# Altium project Mini RFDx900 Board V1.PrjPcb
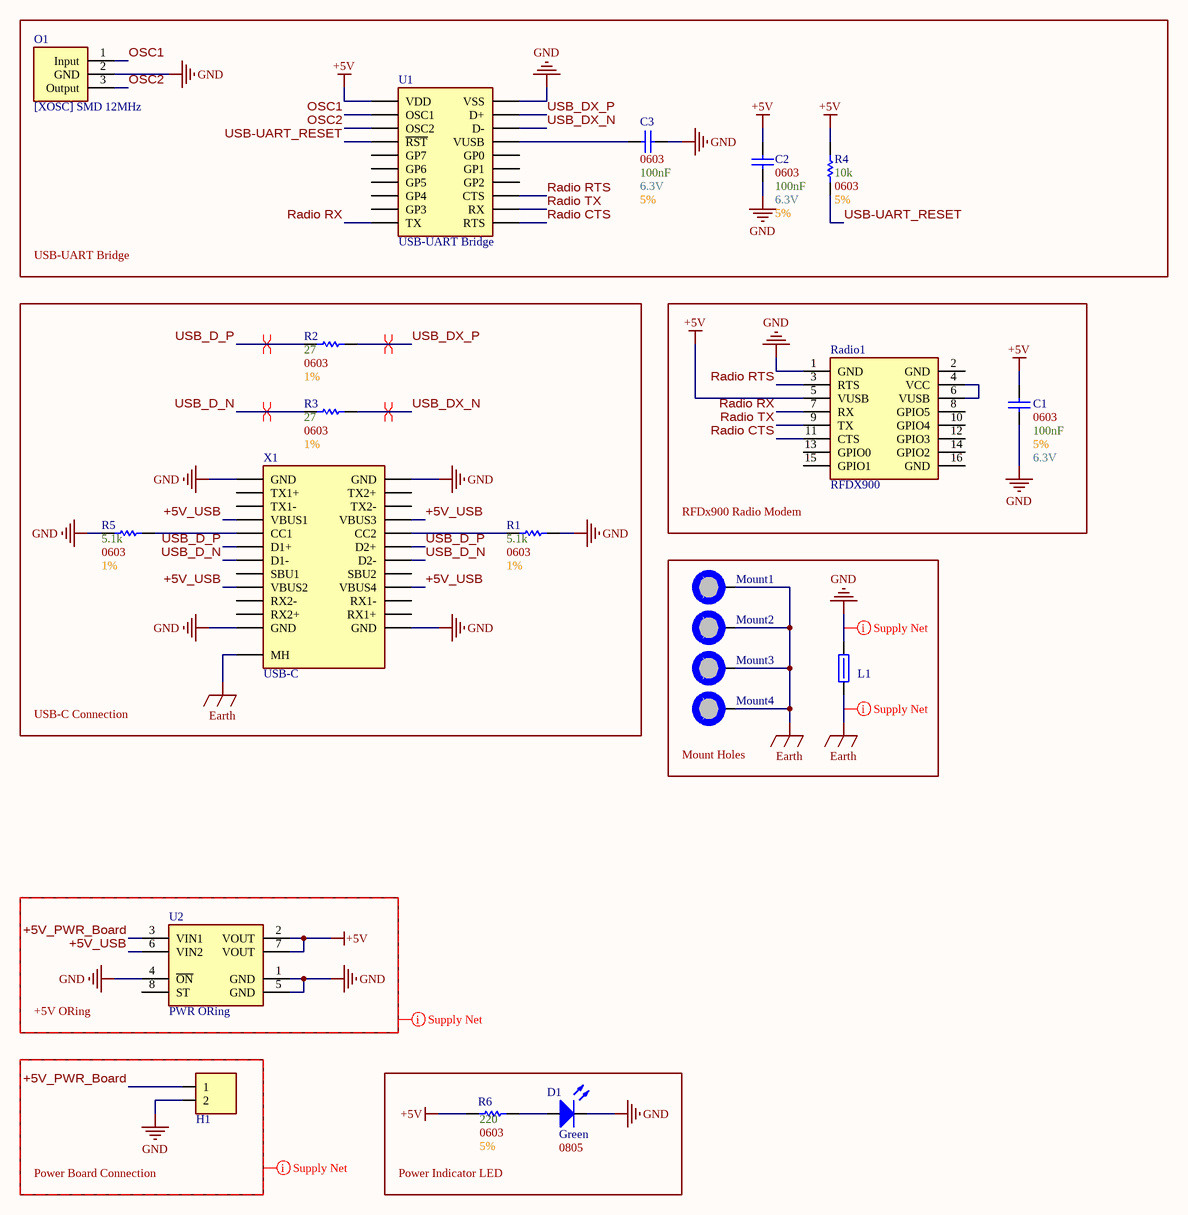
[diagram p0: Main.SchDoc]
1 sheet, 21 parts. Net scope: global (net labels, ports and power ports of the same name join across sheets).
Board file: Main.PcbDoc

## Sheet Main.SchDoc
size B; SheetNumber: 1; SheetTotal: 1

### Parts
C1  Size Package: 0603  Capacitance: 100nF  Voltage: 6.3V  Tolerance: 5%  [[Cap] SMD 0603]  (hidden comment: [Cap] SMD Nonpolarized)
C2  Size Package: 0603  Capacitance: 100nF  Voltage: 6.3V  Tolerance: 5%  [[Cap] SMD 0603]  (hidden comment: [Cap] SMD Nonpolarized)
C3  Size Package: 0603  Capacitance: 100nF  Voltage: 6.3V  Tolerance: 5%  [[Cap] SMD 0603]  (hidden comment: [Cap] SMD Nonpolarized)
D1  Color: Green  Size Package: 0805  [[LED] SMD 0805]  (hidden comment: SMD LED)
H1  1x2 Male  [[Header] Shrouded 1x2 Male]  (value not drawn)
L1  652-MH2029-300Y  [[Ferrite] SMD Bead 0805 (1)]  (value not drawn)
Mount1  M3 Mount Hole  [[Mount] M3 Mount Hole]  (value not drawn)  (no BOM)
Mount2  M3 Mount Hole  [[Mount] M3 Mount Hole]  (value not drawn)  (no BOM)
Mount3  M3 Mount Hole  [[Mount] M3 Mount Hole]  (value not drawn)  (no BOM)
Mount4  M3 Mount Hole  [[Mount] M3 Mount Hole]  (value not drawn)  (no BOM)
O1  [XOSC] SMD 12MHz  [[XOSC] SMD 12MHz]
R1  Tolerance: 1%  Resistance: 5.1k  Size Package: 0603  [[Res] SMD 0603]  (hidden comment: [Res] SMD Resistor)
R2  Tolerance: 1%  Resistance: 27  Size Package: 0603  [[Res] SMD 0603]  (hidden comment: [Res] SMD Resistor)
R3  Tolerance: 1%  Resistance: 27  Size Package: 0603  [[Res] SMD 0603]  (hidden comment: [Res] SMD Resistor)
R4  Resistance: 10k  Size Package: 0603  Tolerance: 5%  [[Res] SMD 0603]  (hidden comment: [Res] SMD Resistor)
R5  Tolerance: 1%  Resistance: 5.1k  Size Package: 0603  [[Res] SMD 0603]  (hidden comment: [Res] SMD Resistor)
R6  Resistance: 220  Size Package: 0603  Tolerance: 5%  [[Res] SMD 0603]  (hidden comment: [Res] SMD Resistor)
Radio1  RFDX900  [[Device] RFDX900 Radio]
U1  USB-UART Bridge  [[IC] USB-UART Bridge]
U2  PWR ORing  [[IC] Power ORing Controller]
X1  USB-C  [[Port] USB-C]

### Blocks framed on the sheet
USB-UART Bridge: C2 C3 O1 R4 U1
USB-C Connection: R1-R3 R5 X1
RFDx900 Radio Modem: C1 Radio1
Mount Holes: L1 Mount1-Mount4
+5V ORing: U2
Power Board Connection: H1
Power Indicator LED: D1 R6

### Nets
+5V: C1.2 C2.2 R4.2 R6.2 Radio1.5(VUSB) U1.1(VDD) U2.2(VOUT) U2.7(VOUT)
Earth: L1.1 Mount1.1 Mount2.1 Mount3.1 Mount4.1 X1.MH
GND: C1.1 C2.1 C3.1 D1.2(Cathode) H1.2 L1.2 O1.2(GND) R1.2 R5.1 Radio1.1(GND) U1.20(VSS) U2.1(GND) U2.4(~{ON}) U2.5(GND) X1.A1(GND) X1.A12(GND) X1.B1(GND) X1.B12(GND)
+5V_PWR_Board: H1.1 U2.3(VIN1)
+5V_USB: U2.6(VIN2) X1.A4(VBUS1) X1.A9(VBUS2) X1.B4(VBUS3) X1.B9(VBUS4)
OSC1: O1.1(Input) U1.2(OSC1)
OSC2: O1.3(Output) U1.3(OSC2)
Radio CTS: Radio1.11(CTS) U1.11(RTS)
Radio RTS: Radio1.3(RTS) U1.13(CTS)
Radio RX: Radio1.7(RX) U1.10(TX)
Radio TX: Radio1.9(TX) U1.12(RX)
USB-UART_RESET: R4.1 U1.4(~{RST})
USB_D_N: R3.1 X1.A7(D1-) X1.B7(D2-)
USB_D_P: R2.1 X1.A6(D1+) X1.B6(D2+)
USB_DX_N: R3.2 U1.18(D-)
USB_DX_P: R2.2 U1.19(D+)
NetC3_2: C3.2 U1.17(VUSB)
NetD1_1: D1.1(Anode) R6.1
NetR1_1: R1.1 X1.B5(CC2)
NetR5_2: R5.2 X1.A5(CC1)
NetRadio1_4: Radio1.4(VCC) Radio1.6(VUSB)

Not connected (* = marked no-connect by the designer): Radio1 2(GND) 8(GPIO5) 10(GPIO4) 12(GPIO3) 13(GPIO0) 14(GPIO2) 15(GPIO1) 16(GND); U1 5(GP7) 6(GP6) 7(GP5) 8(GP4) 9(GP3) 14(GP2) 15(GP1) 16(GP0); U2 8(ST); X1 A2(TX1+) A3(TX1-) A8(SBU1) A10(RX2-) A11(RX2+) B2(TX2+) B3(TX2-) B8(SBU2) B10(RX1-) B11(RX1+)

### Layout directives
differential pair; differential pair class USB_Pairs: USB_D_N, USB_D_P, USB_DX_N, USB_DX_P
net class Supply_Nets: +5V, +5V_PWR_Board, +5V_USB, Earth, GND

### Library data of the parts
D1 = [LED] SMD: Generic; Part #: *; Supplier 1: DigiKey; Supplier Part Number 1: 475-LGR971-KN-1DKR-ND
H1 = [Header] Shrouded 1x2 Male: 0705430036 / Mates with 0050579402; Supplier 1: DigiKey; Supplier 2: DigiKey; Supplier Part Number 2: WM2900-ND; Supplier Part Number 1: WM4824-ND
L1 = [Ferrite] SMD Ferrite Bead (1): Res @ Freq: 30 @ 100MHz; Size Package: 0805; Supplier 1: DigiKey; Supplier Part Number 1: MH2029-300YCT-ND
Mount1-Mount4 = [Mount] M3 Mount Hole: Place at least 4.5mm from board edge. Plated.
R1-R6 = [Res] SMD Resistor: Generic; Supplier 1: DigiKey
  R1 R5: Supplier Part Number 1: 311-5.10KHRDKR-ND
  R2 R3: Supplier Part Number 1: 749-1631-1-ND
  R4: Supplier Part Number 1: 311-10.0KHRDKR-ND
  R6: Supplier Part Number 1: A129741CT-ND
Radio1 = [Device] RFDX900 Radio: RFDX900 Long-Range RF Module; Supplier 1: DigiKey; Supplier Part Number 1: 609-71609-308LF-ND
U1 = [IC] USB-UART Bridge: MCP2200T-I/SO; Supplier 1: DigiKey; Supplier Part Number 1: MCP2200T-I/SOCT-ND
U2 = [IC] Power ORing Controller: Supplier 1: DigiKey; Supplier Part Number 1: 296-LM66200DRLRCT-ND
X1 = [Port] USB Type-C: Supplier 1: DigiKey; Supplier Part Number 1: 670-3104-1-ND
C1-C3 = [Cap] SMD Nonpolarized: Supplier 1: DigiKey; Supplier Part Number 1: 311-1088-6-ND
O1 = [XOSC] SMD 12MHz: Supplier 1: DigiKey; Supplier Part Number 1: 490-17947-1-ND